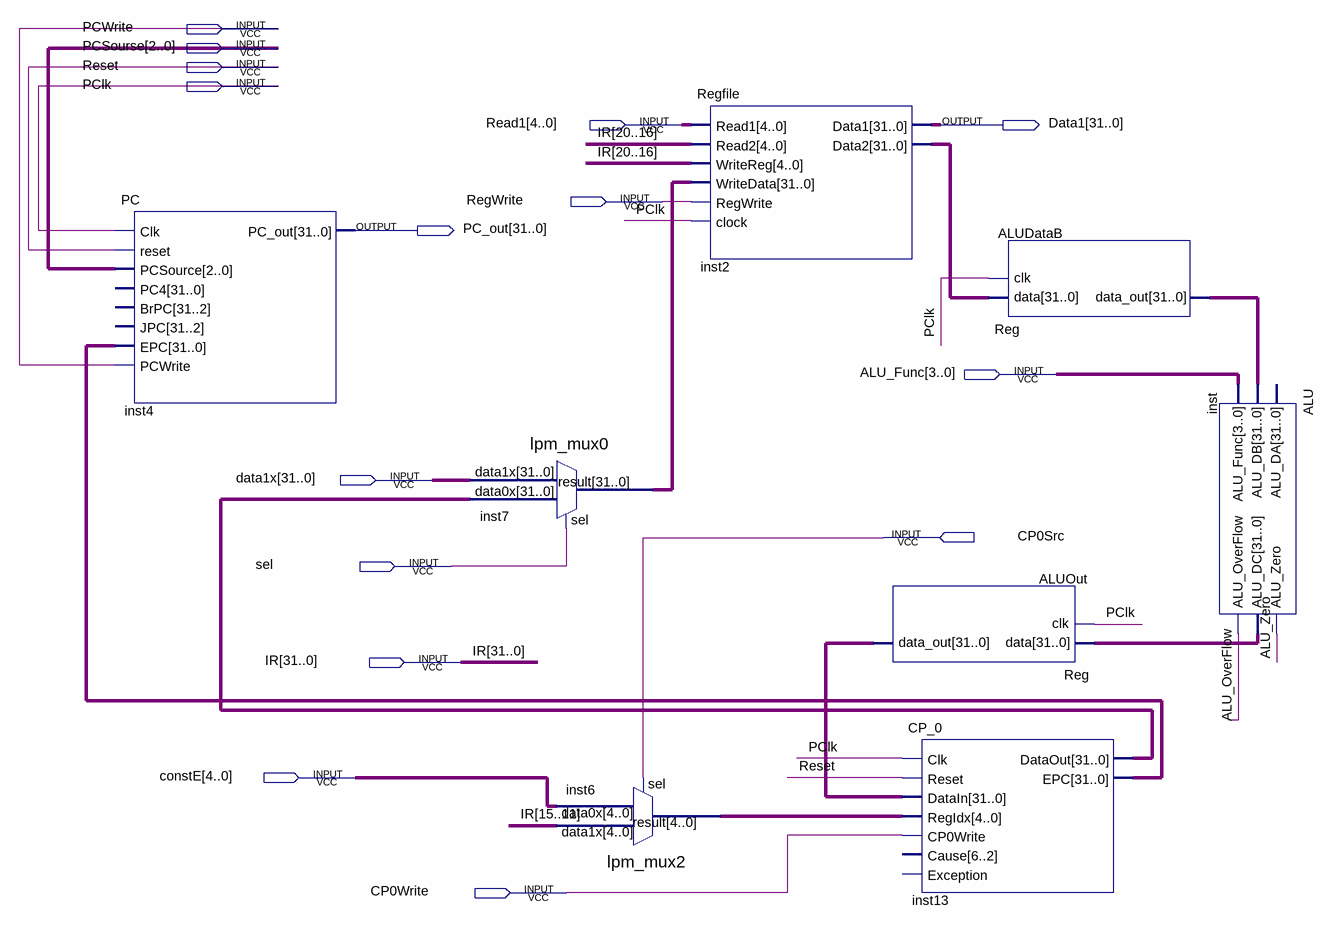
[diagram p0: schematic sheet]
// Quartus schematic cp0.bdf as structural Verilog: 8 symbols, 15 pins
module cp0 (
  input  PCWrite,
  input  [2:0] PCSourse,
  input  Reset,
  input  PClk,
  input  [4:0] Read1,
  input  RegWrite,
  input  [3:0] ALU_Func,
  input  [31:0] data1x,
  input  CP0Src,
  input  sel,
  input  [31:0] IR,
  input  [4:0] constE,
  input  CP0Write,
  output [31:0] Data1,
  output [31:0] PC_out
);

  wire ALU_OverFlow, ALU_Zero;
  wire [4:0] inst6_result;
  wire [31:0] ALUDataB_data_out, ALUOut_data_out, inst2_data2, inst7_result, inst13_dataout, inst13_epc,
       inst_alu_dc;

  PC inst4 (
    .Clk(PClk), .reset(Reset), .PCSource(PCSourse), .EPC(inst13_epc), .PCWrite(PCWrite), .PC_out(PC_out));  // open: PC4, BrPC, JPC
  lpm_mux0 inst7 (.data1x(data1x), .data0x(inst13_dataout), .sel(sel), .result(inst7_result));
  lpm_mux2 inst6 (.data1x(IR[15:11]), .data0x(constE), .sel(CP0Src), .result(inst6_result));
  Regfile inst2 (
    .Read1(Read1), .Read2(IR[20:16]), .WriteReg(IR[20:16]), .WriteData(inst7_result), .RegWrite(RegWrite),
    .clock(PClk), .Data1(Data1), .Data2(inst2_data2));
  Reg ALUOut (.data(inst_alu_dc), .clk(PClk), .data_out(ALUOut_data_out));
  CP_0 inst13 (
    .Clk(PClk), .Reset(Reset), .DataIn(ALUOut_data_out), .RegIdx(inst6_result), .CP0Write(CP0Write),
    .DataOut(inst13_dataout), .EPC(inst13_epc));  // open: Cause, Exception
  Reg ALUDataB (.data(inst2_data2), .clk(PClk), .data_out(ALUDataB_data_out));
  ALU inst (
    .ALU_DB(ALUDataB_data_out), .ALU_Func(ALU_Func), .ALU_Zero(ALU_Zero), .ALU_DC(inst_alu_dc),
    .ALU_OverFlow(ALU_OverFlow));  // open: ALU_DA
endmodule
